# Altium schematic sheet NPNTransistorElement.SchDoc
size A3
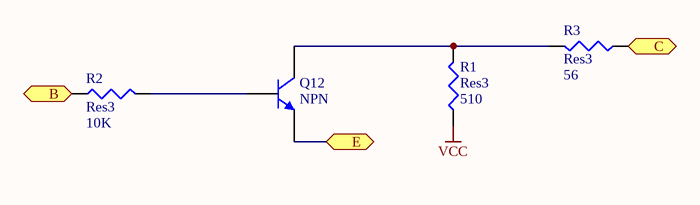
[diagram p0: NPNTransistorElement.SchDoc]

## Parts
Q12  NPN  [SOT95P230-3N]
R1  Res3  value 510  [J1-0603]
R2  Res3  value 10K  [J1-0603]
R3  Res3  value 56  [J1-0603]

## Ports
B, C, E

## Nets
VCC: R1.1
B: R2.1 ; port B
C: R3.1 ; port C
E: Q12.3(E) ; port E
NetQ12_1: Q12.1(C) R1.2 R3.2
NetQ12_2: Q12.2(B) R2.2

## Library data of the parts
Q12 = NPN: NPN Bipolar Transistor; Published: 8-Jun-2000; LatestRevisionDate: 17-Jul-2002; LatestRevisionNote: Re-released for DXP Platform.; PackageReference: TO-226-AA; Publisher: Altium Limited; PackageDescription: TO, Flat Index; 3 In-Line, Axial Leads; Body Dia. 4.8mm; Leads 0.55 x 0.51 mm (max); Code_JEDEC: TO-226-AA
R1-R3 = Res3: Resistor; Published: 8-Jun-2000; LatestRevisionDate: 29-May-2009; LatestRevisionNote: IPC-7351 Footprint Added.; PackageReference: J1-0603; Publisher: Altium Limited; PackageDescription: Chip Resistor